# Altium schematic sheet pinouts.SchDoc
size 297 x 209 mm
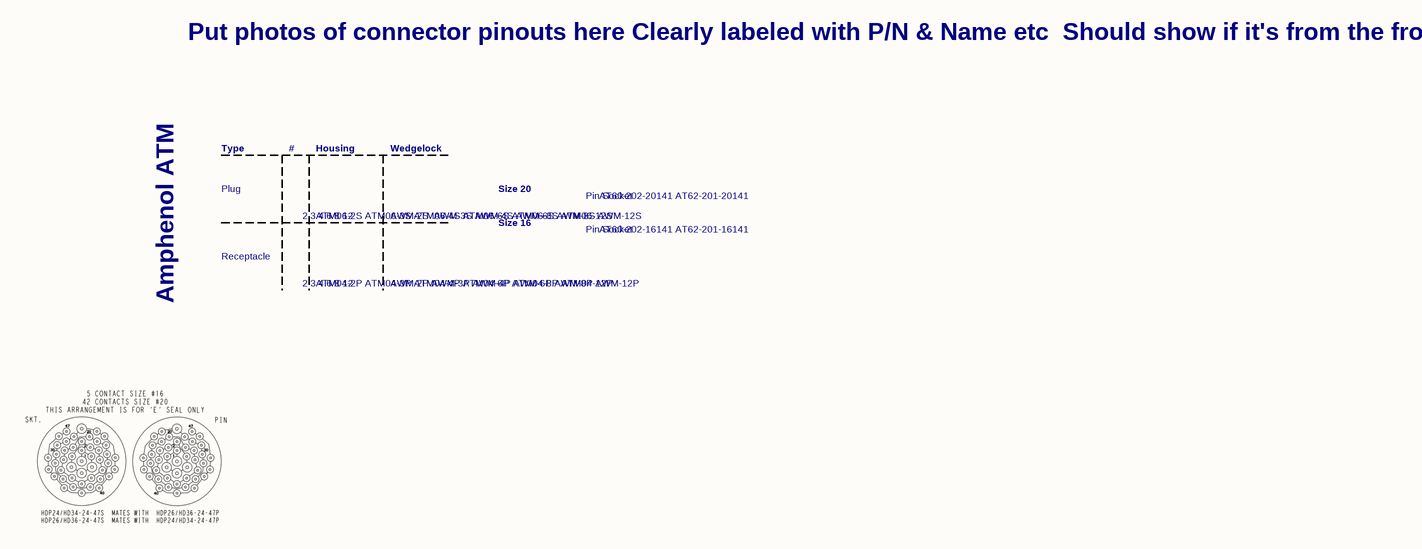
[diagram p0: pinouts.SchDoc]

## Notes on the sheet
- Put photos of connector pinouts here
  Clearly labeled with P/N & Name etc
  Should show if it's from the front or the back
- Type
- #
- Housing
- Wedgelock
- Plug
- 2
  3
  4
  6
  8
  12
- ATM06-2S
  ATM06-3S
  ATM06-4S
  ATM06-6S
  ATM06-8S
  ATM06-12S
- AWM-2S
  AWM-3S
  AWM-4S
  AWM-6S
  AWM-8S
  AWM-12S
- Size 20
- Size 16
- Pin
  Socket
- AT60-202-20141
  AT62-201-20141
- AT60-202-16141
  AT62-201-16141
- Amphenol ATM
- Receptacle
- ATM04-2P
  ATM04-3P
  ATM04-4P
  ATM04-6P
  ATM04-8P
  ATM04-12P
- AWM-2P
  AWM-3P
  AWM-4P
  AWM-6P
  AWM-8P
  AWM-12P
- 1
- 2
- 3
- 4
- 5
- 6
- A
- B
- C
- D
- Title: MISC  - PINOUTS
- File: pinouts.kicad_sch
- Sheet: /
- KiCad E.D.A.  kicad (5.1.4)-1
- Size: A4
- Date:
- Rev:
- Id: 1/1